# Altium schematic sheet GPS_Receiver.SchDoc
size A4; DocumentNumber: 16; SheetNumber: 16; SheetTotal: 47
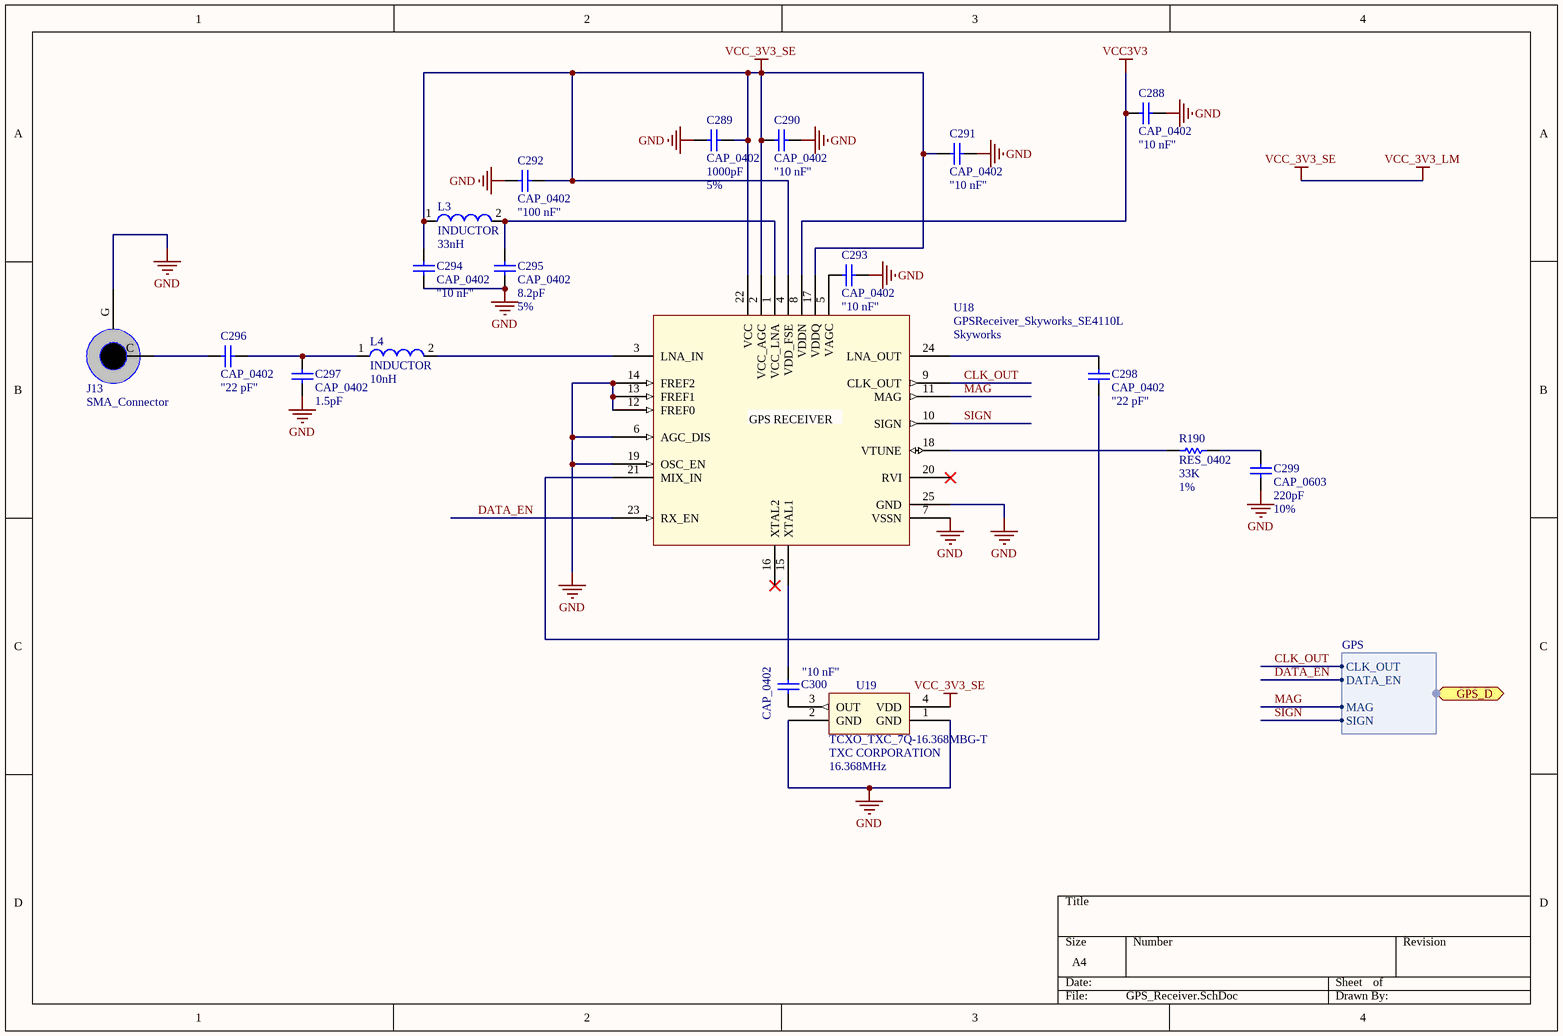
[diagram p0: GPS_Receiver.SchDoc]

## Parts
C288  CAP_0402  value "10 nF"  [CAPC0402(1005)60_N]
C289  CAP_0402  value 1000pF  Tolerance: 5%  [CAPC0402(1005)60_N]
C290  CAP_0402  value "10 nF"  [CAPC0402(1005)60_N]
C291  CAP_0402  value "10 nF"  [CAPC0402(1005)60_N]
C292  CAP_0402  value "100 nF"  [CAPC0402(1005)60_N]
C293  CAP_0402  value "10 nF"  [CAPC0402(1005)60_N]
C294  CAP_0402  value "10 nF"  [CAPC0402(1005)60_N]
C295  CAP_0402  value 8.2pF  Tolerance: 5%  [CAPC0402(1005)60_N]
C296  CAP_0402  value "22 pF"  [CAPC0402(1005)60_N]
C297  CAP_0402  value 1.5pF  [CAPC0402(1005)60_N]
C298  CAP_0402  value "22 pF"  [CAPC0402(1005)60_N]
C299  CAP_0603  value 220pF  Tolerance: 10%  [CAPC0603(1608)100_N]
C300  CAP_0402  value "10 nF"  [CAPC0402(1005)60_N]
J13  SMA_Connector  [Connector_SMA_Amphenol_132255_Edgemount]
L3  INDUCTOR  value 33nH  [Inductor0402(1005)]
L4  INDUCTOR  value 10nH  [Inductor0402(1005)]
R190  RES_0402  value 33K  Tolerance: 1%  [RESC0402(1005)_N]
U18  GPSReceiver_Skyworks_SE4110L  Manufacturer: Skyworks  [GPSReceiver_Skyworks_SE4110L_24QFN]
U19  TCXO_TXC_7Q-16.368MBG-T  value 16.368MHz  Manufacturer: TXC CORPORATION  [TCXO_TXC_7Q-16.368MBG-T_4-PIN]

## Ports
GPS_D (harness GPS)

## Harnesses
GPS: CLK_OUT, DATA_EN, MAG, SIGN

## Nets
GND: C288.2 C289.1 C290.1 C291.1 C292.2 C293.1 C294.2 C295.1 C297.1 C299.1 J13.G U18.6(AGC_DIS) U18.7(VSSN) U18.12(FREF0) U18.13(FREF1) U18.14(FREF2) U18.19(OSC_EN) U18.25(GND) U19.1(GND) U19.2(GND)
VCC3V3: C288.1 U18.8(VDDN)
VCC_3V3_LM: C289.2 C290.2 C291.2 C292.1 C294.1 L3.1 U18.2(VCC_AGC) U18.4(VDD_FSE) U18.17(VDDQ) U18.22(VCC) U19.4(VDD)  [also labelled VCC_3V3_SE]
CLK_OUT: U18.9(CLK_OUT) ; port GPS_D.CLK_OUT
DATA_EN: U18.23(RX_EN) ; port GPS_D.DATA_EN
MAG: U18.11(MAG) ; port GPS_D.MAG
SIGN: U18.10(SIGN) ; port GPS_D.SIGN
NetC293_2: C293.2 U18.5(VAGC)
NetC295_2: C295.2 L3.2 U18.1(VCC_LNA)
NetC296_1: C296.1 J13.C
NetC296_2: C296.2 C297.2 L4.1
NetC298_1: C298.1 U18.21(MIX_IN)
NetC298_2: C298.2 U18.24(LNA_OUT)
NetC299_2: C299.2 R190.2
NetC300_1: C300.1 U19.3(OUT)
NetC300_2: C300.2 U18.15(XTAL1)
NetL4_2: L4.2 U18.3(LNA_IN)
NetR190_1: R190.1 U18.18(VTUNE)

Not connected (* = marked no-connect by the designer): U18 16(XTAL2)* 20(RVI)*

## Notes on the sheet
- (in symbol SE4110L) GPS RECEIVER

## Library data of the parts
C288 C290 C291 C293 C294 C300 = "2238 787 15636": C 10 nF 16 V 0402 X7R; Manufacturer: PHYCOMP; Tolerance: *; Part Number: "2238 787 15636"; Footprint Ref: CAPC0402(1005)60_N; Library Ref: CAP_0402
C289 = TMK105SD102JV-F: CAP CER 1000PF 25V 5% 0402; Manufacturer: Taiyo Yuden; Part Number: TMK105SD102JV-F; Footprint Ref: CAPC0402(1005)60_N; Library Ref: CAP_0402
C292 = "C0402C104K8PAC": C 100 nF 16 V 0402 X5R; Manufacturer: KEMET; Tolerance: *; Part Number: "C0402C104K8PAC"; Footprint Ref: CAPC0402(1005)60_N; Library Ref: CAP_0402
C295 = C0402C829J3GACAUTO: CAP CER 8.2PF 25V 5% NP0 0402; Manufacturer: Kemet; Part Number: C0402C829J3GACAUTO; Footprint Ref: CAPC0402(1005)60_N; Library Ref: CAP_0402
C296 C298 = "GRM1555C1H220JZ01D": C 22 pF 50 V 0402 NP0; Manufacturer: MURATA; Tolerance: *; Part Number: "GRM1555C1H220JZ01D"; Footprint Ref: CAPC0402(1005)60_N; Library Ref: CAP_0402
C297 = GJM1555C1H1R5CB01D: CAP CER 1.5PF 50V NP0 0402; Manufacturer: Murata Electronics North America; Tolerance: *; Part Number: GJM1555C1H1R5CB01D; Footprint Ref: CAPC0402(1005)60_N; Library Ref: CAP_0402
C299 = VJ0603D221KXAAJ: CAP CER 220PF 50V 10% NP0 0603; Manufacturer: Vishay Vitramon; Part Number: VJ0603D221KXAAJ; Footprint Ref: CAPC0603(1608)100_N; Library Ref: CAP_0603
J13 = 132255: CONN RCPT SMA END LAUNCH PCB; Part Number: 132255; Manufacturer: Amphenol Connex
L3 = 0402AF-330: INDUCTOR, 33nH, 0402, DCR 0.06,; Manufacturer: Coilcraft; Tolerance: *; Part Number: 0402AF-330; Library Ref: INDUCTOR; Footprint Ref: Inductor0402(1005)
L4 = 0402CS-10N: INDUCTOR, 10nH, 0402, DCR 0.2,; Manufacturer: Coilcraft; Tolerance: *; Part Number: 0402CS-10N; Library Ref: INDUCTOR; Footprint Ref: Inductor0402(1005)
R190 = RK73H1ETTP3302F: 33K ohms, 1% 1/16W, 0402; Manufacturer: KOA Speer Electronics; Part Number: RK73H1ETTP3302F; Footprint Ref: RESC0402(1005)_N; Library Ref: RES_0402
U18 = SE4110L: High sensitivity / low power GPS and A-GPS,10 mA operating current with 2.7-3.3 V supply; Part Number: SE4110L; Library Ref: GPSReceiver_Skyworks_SE4110L; Footprint Ref: GPSReceiver_Skyworks_SE4110L_24QFN
U19 = 7Q-16.368MBG-T: OSC TCXO 16.368 MHZ 3.3V SMD; Part Number: 7Q-16.368MBG-T; Footprint Ref: TCXO_TXC_7Q-16.368MBG-T_4-PIN; Library Ref: TCXO_TXC_7Q-16.368MBG-T